# Altium schematic sheet logger_sensors.SchDoc
size A
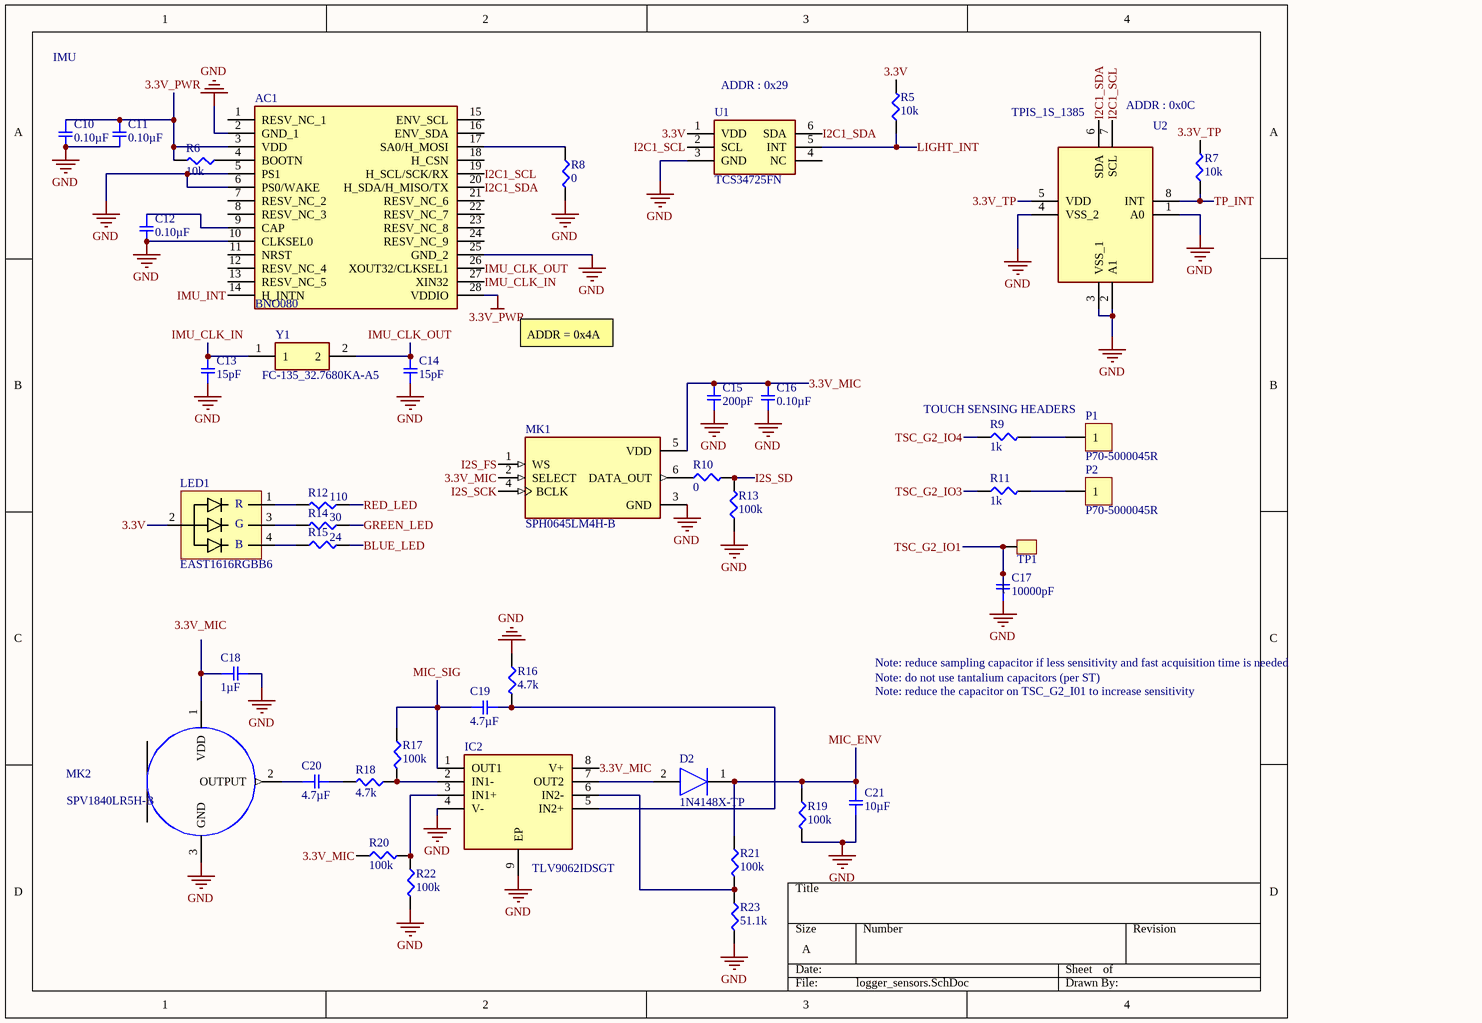
[diagram p0: logger_sensors.SchDoc]

## Parts
AC1  BNO080  [BNO080]
C10  0.10µF  [CAPC1005X55N]
C11  0.10µF  [CAPC1005X55N]
C12  0.10µF  [CAPC1005X55N]
C13  15pF  [CAPC1005X55N]
C14  15pF  [CAPC1005X55N]
C15  200pF  [CAPC1005X55N]
C16  0.10µF  [CAPC1005X55N]
C17  10000pF  [SMD-0402C]
C18  1µF  [SMD-0402C]
C19  4.7µF  [SMD-0402C]
C20  4.7µF  [SMD-0402C]
C21  10µF  [CAPC1005X55N]
D2  1N4148X-TP  [SODFL1608X70N]
IC2  TLV9062IDSGT  [SON50P200X200X80-9N]
LED1  EAST1616RGBB6  [EAST1616RGBB6]
MK1  SPH0645LM4H-B  [MIC_SPH0645LM4H-B]
MK2  SPV1840LR5H-B  [*MIC_SPV1840LR5H-B]
P1  P70-5000045R  [P70-5000045R]
P2  P70-5000045R  [P70-5000045R]
R5  10k  [SMD-0402-RES]
R6  10k  [SMD-0402-RES]
R7  10k  [SMD-0402-RES]
R8  0  [SMD-0402-RES]
R9  1k  [SMD-0402-RES]
R10  0  [SMD-0402-RES]
R11  1k  [SMD-0402-RES]
R12  110  [SMD-0402-RES]
R13  100k  [SMD-0402-RES]
R14  30  [SMD-0402-RES]
R15  24  [SMD-0402-RES]
R16  4.7k  [SMD-0402-RES]
R17  100k  [SMD-0402-RES]
R18  4.7k  [SMD-0402-RES]
R19  100k  [SMD-0402-RES]
R20  100k  [SMD-0402-RES]
R21  100k  [SMD-0402-RES]
R22  100k  [SMD-0402-RES]
R23  51.1k  [SMD-0402-RES]
TP1  TestPoint  [TestPoint_0.4mm]  (value not drawn)
U1  TCS34725FN  [FN_1]
U2  TPIS_1S_1385  [TPIS_1S_1385]  (value not drawn)
Y1  FC-135_32.7680KA-A5  [FC135327680KAAG0]

## Nets
3.3V_PWR: AC1.3(VDD) AC1.28(VDDIO) C10.1 C11.1 R6.2
GND: AC1.2(GND_1) AC1.5(PS1) AC1.6(PS0/WAKE) AC1.10(CLKSEL0) AC1.25(GND_2) C10.2 C11.2 C12.2 C13.2 C14.2 C15.2 C16.2 C17.1 C18.2 C21.2 IC2.4(V-) IC2.9(EP) MK1.3(GND) MK2.3(GND) R8.2 R13.1 R16.1 R19.2 R22.2 R23.2 U1.3(GND) U2.1(A0) U2.2(A1) U2.3(VSS_1) U2.4(VSS_2)
3.3V: LED1.2 R5.2 U1.1(VDD)
3.3V_MIC: C15.1 C16.1 IC2.8(V+) MK1.2(SELECT) MK1.5(VDD) R20.1
3.3V_TP: R7.2 U2.5(VDD)
BLUE_LED: R15.2
GREEN_LED: R14.1
I2C1_SCL: AC1.19(H_SCL/SCK/RX) U1.2(SCL) U2.7(SCL)
I2C1_SDA: AC1.20(H_SDA/H_MISO/TX) U1.6(SDA) U2.6(SDA)
I2S_FS: MK1.1(WS)
I2S_SCK: MK1.4(BCLK)
I2S_SD: R10.2 R13.2
IMU_CLK_IN: AC1.27(XIN32) C13.1 Y1.1
IMU_CLK_OUT: AC1.26(XOUT32/CLKSEL1) C14.1 Y1.2
IMU_INT: AC1.14(H_INTN)
LIGHT_INT: R5.1 U1.5(INT)
MIC_ENV: C21.1 D2.1(K) R19.1 R21.1
MIC_SIG: C19.1 IC2.1(OUT1) R17.1
RED_LED: R12.1
TP_INT: R7.1 U2.8(INT)
TSC_G2_IO1: C17.2 TP1.1
TSC_G2_IO3: R11.1
TSC_G2_IO4: R9.1
NetAC1_4: AC1.4(BOOTN) R6.1
NetAC1_9: AC1.9(CAP) C12.1
NetAC1_17: AC1.17(SA0/H_MOSI) R8.1
NetC18_1: C18.1 MK2.1(VDD)
NetC19_2: C19.2 IC2.5(IN2+) R16.2
NetC20_1: C20.1 MK2.2(OUTPUT)
NetC20_2: C20.2 R18.2
NetD2_2: D2.2(A) IC2.7(OUT2)
NetIC2_2: IC2.2(IN1-) R17.2 R18.1
NetIC2_3: IC2.3(IN1+) R20.2 R22.1
NetIC2_6: IC2.6(IN2-) R21.2 R23.1
NetLED1_1: LED1.1 R12.2
NetLED1_3: LED1.3 R14.2
NetLED1_4: LED1.4 R15.1
NetP1_1: P1.1 R9.2
NetP2_1: P2.1 R11.2

Not connected (* = marked no-connect by the designer): AC1 1(RESV_NC_1) 7(RESV_NC_2) 8(RESV_NC_3) 11(NRST) 12(RESV_NC_4) 13(RESV_NC_5) 15(ENV_SCL) 16(ENV_SDA) 18(H_CSN) 21(RESV_NC_6) 22(RESV_NC_7) 23(RESV_NC_8) 24(RESV_NC_9); MK1 6(DATA_OUT); R10 1; U1 4(NC)

## Notes on the sheet
- IMU
- (near U1) ADDR : 0x29
- (near U2) TPIS_1S_1385
- ADDR : 0x0C
- ADDR = 0x4A
- (near R9) TOUCH SENSING HEADERS
- Note: reduce sampling capacitor if less sensitivity and fast acquisition time is needed
- Note: do not use tantalium capacitors (per ST)
- Note: reduce the capacitor on TSC_G2_I01 to increase sensitivity
- Labels drawn without touching a wire or pin: 3.3V_MIC
- (in symbol EAST1616RGBB6) R; G; B

## Library data of the parts
AC1 = BNO080: Accelerometer; Manufacturer_Name: Hillcrest Laboratories; Datasheet Link: http://www.hillcrestlabs.com/download/5a05f340566d07c196001ec1; Height: 1.18mm; Manufacturer_Part_Number: BNO080
C10-C12 C16 = GCM155R71C104KA55D: CAP CER 0.1UF 16V X7R 0402; Manufacturer: Murata Electronics North America; Factory Stock: 0; Unit Price (USD): 0.1; Minimum Quantity: 1; Tolerance: ±10%; Datasheets: http://www.murata.com/~/media/webrenewal/support/library/catalog/products/capacitor/mlcc/c03e.ashx; Image: //media.digikey.com/Renders/Murata%20Renders/ZRB-SERIES-0402.jpg; Digi-Key Part Number: 490-4759-1-ND; Part Number: GCM155R71C104KA55D; Quantity Available: 734194; @ qty: 0; Packaging: Cut Tape (CT); Series: GCM; Part Status: Active; Value: 0.10µF; Voltage: 16V; Temperature Coefficient: X7R; Operating Temperature: -55°C ~ 125°C; Features: -; Ratings: AEC-Q200; Applications: Automotive; Mounting Type: Surface Mount, MLCC; Package / Case: 0402 (1005 Metric); Size / Dimension: 0.039" L x 0.020" W (1.00mm x 0.50mm); Height - Seated (Max): -; Thickness (Max): 0.022" (0.55mm); Lead Spacing: -; Lead Style: -
C13 C14 = GCM1555C1H150JA16D: CAP CER 15PF 50V NP0 0402; Manufacturer: Murata Electronics North America; Factory Stock: 0; Unit Price (USD): 0.1; Minimum Quantity: 1; Tolerance: ±5%; Temperature Coefficient: C0G, NP0; Datasheets: http://www.murata.com/~/media/webrenewal/support/library/catalog/products/capacitor/mlcc/c03e.ashx; Image: //media.digikey.com/Renders/Murata%20Renders/ZRB-SERIES-0402.jpg; Digi-Key Part Number: 490-11147-1-ND; Part Number: GCM1555C1H150JA16D; Quantity Available: 6185; @ qty: 0; Packaging: Cut Tape (CT); Series: GCM; Part Status: Active; Value: 15pF; Voltage: 50V; Operating Temperature: -55°C ~ 125°C; Features: -; Ratings: AEC-Q200; Applications: Automotive; Mounting Type: Surface Mount, MLCC; Package / Case: 0402 (1005 Metric); Size / Dimension: 0.039" L x 0.020" W (1.00mm x 0.50mm); Height - Seated (Max): -; Thickness (Max): 0.022" (0.55mm); Lead Spacing: -; Lead Style: -
C15 = GCM155R71C104KA55D: CAP CER 200pF 16V X7R 0402; Manufacturer: Murata Electronics North America; Factory Stock: 0; Unit Price (USD): 0.1; Minimum Quantity: 1; Tolerance: ±10%; Datasheets: http://www.murata.com/~/media/webrenewal/support/library/catalog/products/capacitor/mlcc/c03e.ashx; Image: //media.digikey.com/Renders/Murata%20Renders/ZRB-SERIES-0402.jpg; Digi-Key Part Number: 490-4759-1-ND; Part Number: GCM155R71C104KA55D; Quantity Available: 734194; @ qty: 0; Packaging: Cut Tape (CT); Series: GCM; Part Status: Active; Value: 200pF; Voltage: 16V; Temperature Coefficient: X7R; Operating Temperature: -55°C ~ 125°C; Features: -; Ratings: AEC-Q200; Applications: Automotive; Mounting Type: Surface Mount, MLCC; Package / Case: 0402 (1005 Metric); Size / Dimension: 0.039" L x 0.020" W (1.00mm x 0.50mm); Height - Seated (Max): -; Thickness (Max): 0.022" (0.55mm); Lead Spacing: -; Lead Style: -
C17 = GCM155R71H103KA55D: CAP CER 10000PF 50V X7R 0402; Manufacturer: Murata Electronics North America; Factory Stock: 0; Unit Price (USD): 0.1; Minimum Quantity: 1; Tolerance: ±10%; Datasheets: http://www.murata.com/~/media/webrenewal/support/library/catalog/products/capacitor/mlcc/c03e.ashx; Image: //media.digikey.com/Renders/Murata%20Renders/ZRB-SERIES-0402.jpg; Digi-Key Part Number: 490-4762-1-ND; Part Number: GCM155R71H103KA55D; Quantity Available: 650067; @ qty: 0; Packaging: Cut Tape (CT); Series: GCM; Part Status: Active; Value: 10000pF; Voltage: 50V; Temperature Coefficient: X7R; Operating Temperature: -55°C ~ 125°C; Features: -; Ratings: AEC-Q200; Applications: Automotive; Mounting Type: Surface Mount, MLCC; Package / Case: 0402 (1005 Metric); Size / Dimension: 0.039" L x 0.020" W (1.00mm x 0.50mm); Height - Seated (Max): -; Thickness (Max): 0.022" (0.55mm); Lead Spacing: -; Lead Style: -
C18 = GCM155C71A105KE38D: CAP CER 1UF 10V X7S 0402; Manufacturer: Murata Electronics North America; Factory Stock: 0; Unit Price (USD): 0.12; Minimum Quantity: 1; Tolerance: ±10%; Datasheets: http://www.murata.com/~/media/webrenewal/support/library/catalog/products/capacitor/mlcc/c03e.ashx; Image: //media.digikey.com/Renders/Murata%20Renders/ZRB-SERIES-0402.jpg; Digi-Key Part Number: 490-13409-1-ND; Part Number: GCM155C71A105KE38D; Quantity Available: 7240; @ qty: 0; Packaging: Cut Tape (CT); Series: GCM; Part Status: Active; Value: 1µF; Voltage: 10V; Temperature Coefficient: X7S; Operating Temperature: -55°C ~ 125°C; Features: -; Ratings: AEC-Q200; Applications: Automotive; Mounting Type: Surface Mount, MLCC; Package / Case: 0402 (1005 Metric); Size / Dimension: 0.039" L x 0.020" W (1.00mm x 0.50mm); Height - Seated (Max): -; Thickness (Max): 0.022" (0.55mm); Lead Spacing: -; Lead Style: -
C19 C20 = GRM155R60J475ME47D: CAP CER 4.7UF 6.3V X5R 0402; Manufacturer: Murata Electronics North America; Factory Stock: 0; Unit Price (USD): 0.14; Minimum Quantity: 1; Tolerance: ±20%; Datasheets: http://www.murata.com/~/media/webrenewal/support/library/catalog/products/capacitor/mlcc/c02e.pdf; Image: //media.digikey.com/Renders/Murata%20Renders/ZRB-SERIES-0402.jpg; Digi-Key Part Number: 490-5915-1-ND; Part Number: GRM155R60J475ME47D; Quantity Available: 1963747; @ qty: 0; Packaging: Cut Tape (CT); Series: GRM; Part Status: Active; Value: 4.7µF; Voltage: 6.3V; Temperature Coefficient: X5R; Operating Temperature: -55°C ~ 85°C; Features: Derating Recommended; Ratings: -; Applications: General Purpose; Mounting Type: Surface Mount, MLCC; Package / Case: 0402 (1005 Metric); Size / Dimension: 0.039" L x 0.020" W (1.00mm x 0.50mm); Height - Seated (Max): -; Thickness (Max): 0.024" (0.60mm); Lead Spacing: -; Lead Style: -
C21 = GCM155R71C104KA55D: CAP CER 10UF 16V X7R 0402; Manufacturer: Murata Electronics North America; Factory Stock: 0; Unit Price (USD): 0.1; Minimum Quantity: 1; Tolerance: ±10%; Datasheets: http://www.murata.com/~/media/webrenewal/support/library/catalog/products/capacitor/mlcc/c03e.ashx; Image: //media.digikey.com/Renders/Murata%20Renders/ZRB-SERIES-0402.jpg; Digi-Key Part Number: 490-4759-1-ND; Part Number: GCM155R71C104KA55D; Quantity Available: 734194; @ qty: 0; Packaging: Cut Tape (CT); Series: GCM; Part Status: Active; Value: 10µF; Voltage: 16V; Temperature Coefficient: X7R; Operating Temperature: -55°C ~ 125°C; Features: -; Ratings: AEC-Q200; Applications: Automotive; Mounting Type: Surface Mount, MLCC; Package / Case: 0402 (1005 Metric); Size / Dimension: 0.039" L x 0.020" W (1.00mm x 0.50mm); Height - Seated (Max): -; Thickness (Max): 0.022" (0.55mm); Lead Spacing: -; Lead Style: -
D2 = 1N4148X-TP: Diode; Manufacturer_Name: Micro Commercial Components (MCC); Datasheet Link: http://www.mouser.com/ds/2/258/1N4148X(SOD-523)-349105.pdf; Height: 0.7mm; Manufacturer_Part_Number: 1N4148X-TP; Mouser Part Number: 833-1N4148X-TP; Mouser Price/Stock: https://www.mouser.com/Search/Refine.aspx?Keyword=833-1N4148X-TP
IC2 = TLV9062IDSGT: Integrated Circuit; Manufacturer_Name: Texas Instruments; Datasheet Link: http://www.ti.com/lit/gpn/TLV9062; Height: 0.8mm; Manufacturer_Part_Number: TLV9062IDSGT; Mouser Part Number: 595-TLV9062IDSGT; Mouser Price/Stock: https://www.mouser.com/Search/Refine.aspx?Keyword=595-TLV9062IDSGT
MK1 = SPH0645LM4H-B: 20 Hz ~ 10 kHz digitale IÂ²S-Mikrofon-MEMS _Silizium_ 1,62 V ~ 3,6 V omnidirektionale _-26 dB Â± 3 dB bei 94 dB SPL_ LÃ¶tpads; MF: Knowles; Package: SIP-7 Bourns; Digi-Key_Purchase_URL: https://www.digikey.ch/product-detail/en/knowles/SPH0645LM4H-B/423-1405-1-ND/5332432?utm_source=snapeda&utm_medium=aggregator&utm_campaign=symbol; Digi-Key_Part_Number: 423-1405-1-ND; SnapEDA_Link: https://www.snapeda.com/parts/SPH0645LM4H-B/Knowles/view-part/229820/?ref=snap; MP: SPH0645LM4H-B; Value: *
MK2 = SPV1840LR5H-B: Mic Mems Analog; MF: Knowles; MP: SPV1840LR5H-B; Package: 0805 Knowles; SnapEDA_Link: https://www.snapeda.com/parts/SPV1840LR5H-B/Knowles/view-part/?ref=snap; Availability: Unavailable; Price: None; Value: *
R5-R7 = ERJ-2GEJ103X: RES SMD 10K OHM 5% 1/10W 0402; Manufacturer: Panasonic Electronic Components; Factory Stock: 0; Unit Price (USD): 0.00350; @ qty: 1500; Minimum Quantity: 1; Power (Watts): 0.1W, 1/10W; Temperature Coefficient: ±200ppm/°C; Part Number: ERJ-2GEJ103X; Datasheets: http://industrial.panasonic.com/www-cgi/jvcr13pz.cgi?E+PZ+3+AOA0001+ERJ2GEJ103X+7+WW; Image: //media.digikey.com/Photos/Panasonic%20Photos/ERJ-PA2-Series.jpg; Digi-Key Part Number: P10KJCT-ND; Quantity Available: 2560215; Packaging: Cut Tape (CT); Series: ERJ; Part Status: Active; Value: 10k; Tolerance: ±5%; Composition: Thick Film; Features: Automotive AEC-Q200; Operating Temperature: -55°C ~ 155°C; Package / Case: 0402 (1005 Metric); Supplier Device Package: 0402; Size / Dimension: 0.039" L x 0.020" W (1.00mm x 0.50mm); Height - Seated (Max): 0.016" (0.40mm); Number of Terminations: 2; Failure Rate: -
R8 R10 = ERJ-2GEJ103X: RES SMD 0K OHM 5% 1/10W 0402; Manufacturer: Panasonic Electronic Components; Unit Price (USD): 0.00350; @ qty: 1500; Minimum Quantity: 1; Power (Watts): 0.1W, 1/10W; Temperature Coefficient: ±200ppm/°C; Part Number: ERJ-2GEJ103X; Datasheets: http://industrial.panasonic.com/www-cgi/jvcr13pz.cgi?E+PZ+3+AOA0001+ERJ2GEJ103X+7+WW; Image: //media.digikey.com/Photos/Panasonic%20Photos/ERJ-PA2-Series.jpg; Digi-Key Part Number: P10KJCT-ND; Quantity Available: 2560215; Factory Stock: 0; Packaging: Cut Tape (CT); Series: ERJ; Part Status: Active; Value: 0; Tolerance: ±5%; Composition: Thick Film; Features: Automotive AEC-Q200; Operating Temperature: -55°C ~ 155°C; Package / Case: 0402 (1005 Metric); Supplier Device Package: 0402; Size / Dimension: 0.039" L x 0.020" W (1.00mm x 0.50mm); Height - Seated (Max): 0.016" (0.40mm); Number of Terminations: 2; Failure Rate: -
R9 R11 = ERJ-2GEJ102X: RES SMD 1K OHM 5% 1/10W 0402; Manufacturer: Panasonic Electronic Components; Factory Stock: 0; Unit Price (USD): 0.00350; @ qty: 1500; Minimum Quantity: 1; Power (Watts): 0.1W, 1/10W; Temperature Coefficient: ±200ppm/°C; Part Number: ERJ-2GEJ102X; Datasheets: http://industrial.panasonic.com/www-cgi/jvcr13pz.cgi?E+PZ+3+AOA0001+ERJ2GEJ102X+7+WW; Image: //media.digikey.com/Photos/Panasonic%20Photos/ERJ-PA2-Series.jpg; Digi-Key Part Number: P1.0KJCT-ND; Quantity Available: 1939857; Packaging: Cut Tape (CT); Series: ERJ; Part Status: Active; Value: 1k; Tolerance: ±5%; Composition: Thick Film; Features: Automotive AEC-Q200; Operating Temperature: -55°C ~ 155°C; Package / Case: 0402 (1005 Metric); Supplier Device Package: 0402; Size / Dimension: 0.039" L x 0.020" W (1.00mm x 0.50mm); Height - Seated (Max): 0.016" (0.40mm); Number of Terminations: 2; Failure Rate: -
R12 R14 R15 = ERJ-2GEJ103X: RES SMD 110 OHM 5% 1/10W 0402; Manufacturer: Panasonic Electronic Components; Factory Stock: 0; Unit Price (USD): 0.00350; @ qty: 1500; Minimum Quantity: 1; Power (Watts): 0.1W, 1/10W; Temperature Coefficient: ±200ppm/°C; Part Number: ERJ-2GEJ103X; Datasheets: http://industrial.panasonic.com/www-cgi/jvcr13pz.cgi?E+PZ+3+AOA0001+ERJ2GEJ103X+7+WW; Image: //media.digikey.com/Photos/Panasonic%20Photos/ERJ-PA2-Series.jpg; Digi-Key Part Number: P10KJCT-ND; Quantity Available: 2560215; Packaging: Cut Tape (CT); Series: ERJ; Part Status: Active; Tolerance: ±5%; Composition: Thick Film; Features: Automotive AEC-Q200; Operating Temperature: -55°C ~ 155°C; Package / Case: 0402 (1005 Metric); Supplier Device Package: 0402; Size / Dimension: 0.039" L x 0.020" W (1.00mm x 0.50mm); Height - Seated (Max): 0.016" (0.40mm); Number of Terminations: 2; Failure Rate: -
  R12: Value: 110
  R14: Value: 30
  R15: Value: 24
R13 R17 R19-R22 = ERJ-2GEJ103X: RES SMD 100K OHM 5% 1/10W 0402; Manufacturer: Panasonic Electronic Components; Factory Stock: 0; Unit Price (USD): 0.00350; @ qty: 1500; Minimum Quantity: 1; Power (Watts): 0.1W, 1/10W; Temperature Coefficient: ±200ppm/°C; Part Number: ERJ-2GEJ103X; Datasheets: http://industrial.panasonic.com/www-cgi/jvcr13pz.cgi?E+PZ+3+AOA0001+ERJ2GEJ103X+7+WW; Image: //media.digikey.com/Photos/Panasonic%20Photos/ERJ-PA2-Series.jpg; Digi-Key Part Number: P10KJCT-ND; Quantity Available: 2560215; Packaging: Cut Tape (CT); Series: ERJ; Part Status: Active; Value: 100k; Tolerance: ±5%; Composition: Thick Film; Features: Automotive AEC-Q200; Operating Temperature: -55°C ~ 155°C; Package / Case: 0402 (1005 Metric); Supplier Device Package: 0402; Size / Dimension: 0.039" L x 0.020" W (1.00mm x 0.50mm); Height - Seated (Max): 0.016" (0.40mm); Number of Terminations: 2; Failure Rate: -
R16 R18 = ERJ-2GEJ103X: RES SMD 4.7K OHM 5% 1/10W 0402; Manufacturer: Panasonic Electronic Components; Factory Stock: 0; Unit Price (USD): 0.00350; @ qty: 1500; Minimum Quantity: 1; Power (Watts): 0.1W, 1/10W; Temperature Coefficient: ±200ppm/°C; Part Number: ERJ-2GEJ103X; Datasheets: http://industrial.panasonic.com/www-cgi/jvcr13pz.cgi?E+PZ+3+AOA0001+ERJ2GEJ103X+7+WW; Image: //media.digikey.com/Photos/Panasonic%20Photos/ERJ-PA2-Series.jpg; Digi-Key Part Number: P10KJCT-ND; Quantity Available: 2560215; Packaging: Cut Tape (CT); Series: ERJ; Part Status: Active; Value: 4.7k; Tolerance: ±5%; Composition: Thick Film; Features: Automotive AEC-Q200; Operating Temperature: -55°C ~ 155°C; Package / Case: 0402 (1005 Metric); Supplier Device Package: 0402; Size / Dimension: 0.039" L x 0.020" W (1.00mm x 0.50mm); Height - Seated (Max): 0.016" (0.40mm); Number of Terminations: 2; Failure Rate: -
R23 = ERJ-2GEJ103X: RES SMD 51.1K OHM 5% 1/10W 0402; Manufacturer: Panasonic Electronic Components; Factory Stock: 0; Unit Price (USD): 0.00350; @ qty: 1500; Minimum Quantity: 1; Power (Watts): 0.1W, 1/10W; Temperature Coefficient: ±200ppm/°C; Part Number: ERJ-2GEJ103X; Datasheets: http://industrial.panasonic.com/www-cgi/jvcr13pz.cgi?E+PZ+3+AOA0001+ERJ2GEJ103X+7+WW; Image: //media.digikey.com/Photos/Panasonic%20Photos/ERJ-PA2-Series.jpg; Digi-Key Part Number: P10KJCT-ND; Quantity Available: 2560215; Packaging: Cut Tape (CT); Series: ERJ; Part Status: Active; Value: 51.1k; Tolerance: ±5%; Composition: Thick Film; Features: Automotive AEC-Q200; Operating Temperature: -55°C ~ 155°C; Package / Case: 0402 (1005 Metric); Supplier Device Package: 0402; Size / Dimension: 0.039" L x 0.020" W (1.00mm x 0.50mm); Height - Seated (Max): 0.016" (0.40mm); Number of Terminations: 2; Failure Rate: -
U1 = TCS34725FN: Undefined or Miscellaneous; Manufacturer_Name: ams; Datasheet Link: https://ams.com/jpn/content/download/319364/1117183/file/TCS3472_Datasheet_EN_v2.pdf; Manufacturer_Part_Number: TCS34725FN; Mouser Part Number: 985-TCS34725FN; Mouser Price/Stock: https://www.mouser.com/Search/Refine.aspx?Keyword=985-TCS34725FN; RS Part Number: 1024173P; RS Price/Stock: http://china.rs-online.com/web/p/products/1024173P
U2 = TPIS_1S_1385: Undefined or Miscellaneous; Manufacturer_Name: Excelitas Technologies; Manufacturer_Part_Number: TPIS 1S 1385; Datasheet Link: http://media.digikey.com/pdf/Data%20Sheets/Excelitas%20PDFs/TPiS_1S_1385.pdf
Y1 = FC-135_32.7680KA-A3: Crystal or Oscillator; Manufacturer_Name: Epson Timing; Manufacturer_Part_Number: FC-135 32.7680KA-A5; Datasheet Link: https://support.epson.biz/td/api/doc_check.php?dl=brief_fc-135r_en.pdf; Height: 0mm; Mouser Part Number: 732-FC135-32.76KAA3; Mouser Price/Stock: https://www.mouser.com/Search/Refine.aspx?Keyword=732-FC135-32.76KAA3